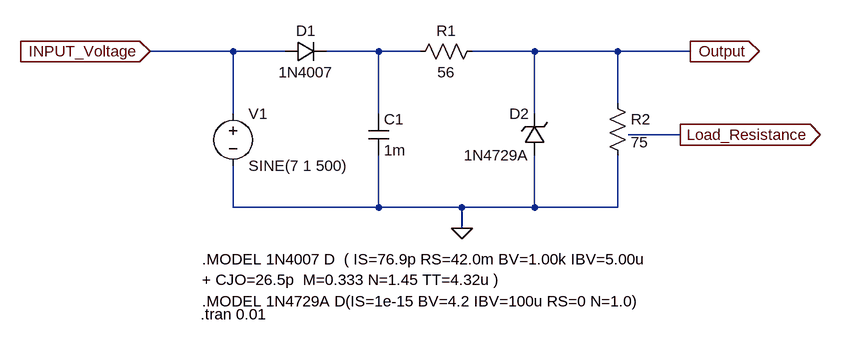
[diagram p0: schematic Circuit.asc]
Circuit.asc, the LTspice schematic file:
Version 4
SHEET 1 1020 680
WIRE 80 32 -48 32
WIRE 160 32 80 32
WIRE 304 32 224 32
WIRE 368 32 304 32
WIRE 544 32 448 32
WIRE 672 32 544 32
WIRE 784 32 672 32
WIRE 672 112 672 32
WIRE 80 128 80 32
WIRE 304 128 304 32
WIRE 544 128 544 32
WIRE 768 160 688 160
WIRE 80 272 80 208
WIRE 304 272 304 192
WIRE 304 272 80 272
WIRE 432 272 304 272
WIRE 544 272 544 192
WIRE 544 272 432 272
WIRE 672 272 672 192
WIRE 672 272 544 272
WIRE 432 304 432 272
FLAG 432 304 0
FLAG -48 32 INPUT_Voltage
IOPIN -48 32 In
FLAG 784 32 Output
IOPIN 784 32 Out
FLAG 768 160 Load_Resistance
IOPIN 768 160 Out
SYMBOL voltage 80 112 R0
WINDOW 123 0 0 Left 2
WINDOW 39 0 0 Left 2
SYMATTR InstName V1
SYMATTR Value SINE(7 1 500)
SYMBOL diode 160 48 R270
WINDOW 0 32 32 VTop 2
WINDOW 3 0 32 VBottom 2
SYMATTR InstName D1
SYMATTR Value 1N4007
SYMBOL res 464 16 R90
WINDOW 0 0 56 VBottom 2
WINDOW 3 32 56 VTop 2
SYMATTR InstName R1
SYMATTR Value 56
SYMBOL cap 288 128 R0
SYMATTR InstName C1
SYMATTR Value 1m
SYMBOL zener 560 192 R180
WINDOW 0 24 64 Left 2
WINDOW 3 24 0 Left 2
SYMATTR InstName D2
SYMATTR Value 1N4729A
SYMBOL res 656 96 R0
SYMATTR InstName R2
SYMATTR Value 75
TEXT 32 352 Left 2 !.MODEL 1N4007 D  ( IS=76.9p RS=42.0m BV=1.00k IBV=5.00u\n+ CJO=26.5p  M=0.333 N=1.45 TT=4.32u )
TEXT 32 416 Left 2 !.MODEL 1N4729A D(IS=1e-15 BV=4.2 IBV=100u RS=0 N=1.0)
TEXT 30 436 Left 2 !.tran 0.01

The netlist it stands for:
* Circuit.asc
V1 INPUT_Voltage 0 SINE(7 1 500)
D1 INPUT_Voltage N001 1N4007
R1 Output N001 56
C1 N001 0 1m
D2 0 Output 1N4729A
R2 Output 0 75
.model D D
.lib standard.dio
.MODEL 1N4007 D  ( IS=76.9p RS=42.0m BV=1.00k IBV=5.00u
+ CJO=26.5p  M=0.333 N=1.45 TT=4.32u )
.MODEL 1N4729A D(IS=1e-15 BV=4.2 IBV=100u RS=0 N=1.0)
.tran 0.01
.backanno
.end